# Altium schematic sheet VFD_alpha_Sheet2.SchDoc
size A4
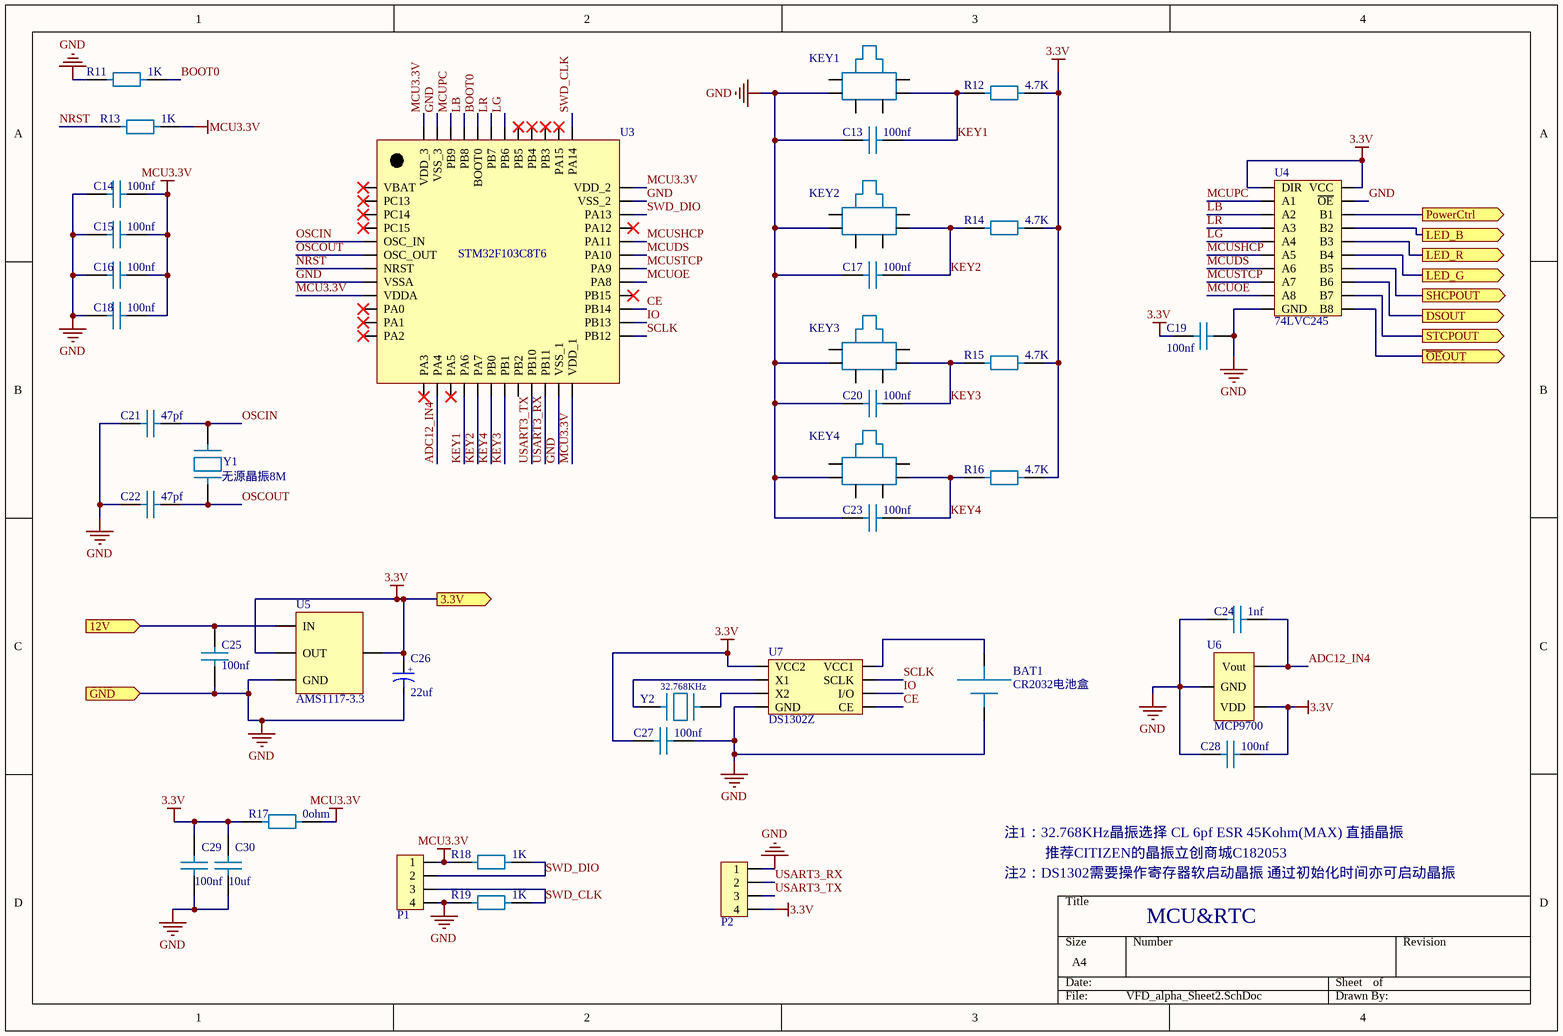
[diagram p0: VFD_alpha_Sheet2.SchDoc]

## Parts
BAT1  CR2032电池盒  [SBAT-CR2032]
C13  value 100nf  [0603]  (hidden comment: C)
C14  value 100nf  [0603]  (hidden comment: C)
C15  value 100nf  [0603]  (hidden comment: C)
C16  value 100nf  [0603]  (hidden comment: C)
C17  value 100nf  [0603]  (hidden comment: C)
C18  value 100nf  [0603]  (hidden comment: C)
C19  value 100nf  [0603]  (hidden comment: C)
C20  value 100nf  [0603]  (hidden comment: C)
C21  value 47pf  [0603]  (hidden comment: C)
C22  value 47pf  [0603]  (hidden comment: C)
C23  value 100nf  [0603]  (hidden comment: C)
C24  value 1nf  [0603]  (hidden comment: C)
C25  value 100nf  [0805]  (hidden comment: C(0805))
C26  value 22uf  [CAPCP3216X06N]  (hidden comment: 钽电容)
C27  value 100nf  [0603]  (hidden comment: C)
C28  value 100nf  [0603]  (hidden comment: C)
C29  value 100nf  [0603]  (hidden comment: C)
C30  value 10uf  [0603]  (hidden comment: C)
KEY1  无锁按键  [侧面按键]  (value not drawn)
KEY2  无锁按键  [侧面按键]  (value not drawn)
KEY3  无锁按键  [侧面按键]  (value not drawn)
KEY4  无锁按键  [侧面按键]  (value not drawn)
P1  连接器4P  [Connector4P]  (value not drawn)
P2  连接器4P  [Connector4P]  (value not drawn)
R11  value 1K  [0603]  (hidden comment: R)
R12  value 4.7K  [0603]  (hidden comment: R)
R13  value 1K  [0603]  (hidden comment: R)
R14  value 4.7K  [0603]  (hidden comment: R)
R15  value 4.7K  [0603]  (hidden comment: R)
R16  value 4.7K  [0603]  (hidden comment: R)
R17  value 0ohm  [0603]  (hidden comment: R)
R18  value 1K  [0603]  (hidden comment: R)
R19  value 1K  [0603]  (hidden comment: R)
U3  STM32F103C8T6  [STM32F103x8LQFP48]
U4  74LVC245  [TSOP-20N-74LVC245]
U5  AMS1117-3.3  [AMS1117-3.3]
U6  MCP9700  [SOT-23-s8550]
U7  DS1302Z  [SOIC-8P DS1302Z]
Y1  无源晶振8M  [晶振8M]
Y2  直插无源晶振32.768KHz  [2*6_OSC]  (value not drawn)

## Ports
3.3V (out), 12V (in), DSOUT (out), GND (in), LED_B (out), LED_G (out), LED_R (out), PowerCtrl (out), SHCPOUT (out), STCPOUT (out), ~{OE}OUT (out)

## Nets
3.3V: C19.1 C26.1 C27.1 C28.2 C29.2 C30.2 P2.4 R12.2 R14.2 R15.2 R16.2 R17.1 U4.1(DIR) U4.20(VCC) U5.2(OUT) U5.4 U6.1(VDD) U7.1(VCC2) ; port 3.3V
GND: BAT1.1 C13.1 C14.1 C15.1 C16.1 C17.1 C18.1 C19.2 C20.1 C21.1 C22.1 C23.1 C24.1 C25.1 C26.2 C27.2 C28.1 C29.1 C30.1 KEY1.2 KEY2.2 KEY3.2 KEY4.2 P1.4 P2.1 R11.2 R19.1 U3.8(VSSA) U3.23(VSS_1) U3.35(VSS_2) U3.47(VSS_3) U4.10(GND) U4.19(~{OE}) U5.1(GND) U6.2(GND) U7.4(GND) ; port GND
MCU3.3V: C14.2 C15.2 C16.2 C18.2 P1.1 R13.2 R17.2 R18.2 U3.9(VDDA) U3.24(VDD_1) U3.36(VDD_2) U3.48(VDD_3)
12V: C25.2 U5.3(IN) ; port 12V
~{OE}OUT: U4.11(B8) ; port ~{OE}OUT
ADC12_IN4: C24.2 U3.14(PA4) U6.3(Vout)
BOOT0: R11.1 U3.44(BOOT0)
CE: U3.27(PB14) U7.5(CE)
DSOUT: U4.13(B6) ; port DSOUT
IO: U3.26(PB13) U7.6(I/O)
KEY1: C13.2 KEY1.5 R12.1 U3.16(PA6)
KEY2: C17.2 KEY2.5 R14.1 U3.17(PA7)
KEY3: C20.2 KEY3.5 R15.1 U3.19(PB1)
KEY4: C23.2 KEY4.5 R16.1 U3.18(PB0)
LB: U3.45(PB8) U4.3(A2)
LED_B: U4.17(B2) ; port LED_B
LED_G: U4.15(B4) ; port LED_G
LED_R: U4.16(B3) ; port LED_R
LG: U3.42(PB6) U4.5(A4)
LR: U3.43(PB7) U4.4(A3)
MCUDS: U3.31(PA10) U4.7(A6)
MCUOE: U3.29(PA8) U4.9(A8)
MCUPC: U3.46(PB9) U4.2(A1)
MCUSHCP: U3.32(PA11) U4.6(A5)
MCUSTCP: U3.30(PA9) U4.8(A7)
NRST: R13.1 U3.7(NRST)
OSCIN: C21.2 U3.5(OSC_IN) Y1.2
OSCOUT: C22.2 U3.6(OSC_OUT) Y1.1
PowerCtrl: U4.18(B1) ; port PowerCtrl
SCLK: U3.25(PB12) U7.7(SCLK)
SHCPOUT: U4.14(B5) ; port SHCPOUT
STCPOUT: U4.12(B7) ; port STCPOUT
SWD_CLK: P1.3 R19.2 U3.37(PA14)
SWD_DIO: P1.2 R18.1 U3.34(PA13)
USART3_RX: P2.2 U3.22(PB11)
USART3_TX: P2.3 U3.21(PB10)
NetBAT1_2: BAT1.2 U7.8(VCC1)
NetU7_2: U7.2(X1) Y2.1
NetU7_3: U7.3(X2) Y2.2

Not connected (* = marked no-connect by the designer): KEY1 1 3 4 6; KEY2 1 3 4 6; KEY3 1 3 4 6; KEY4 1 3 4 6; U3 1(VBAT)* 2(PC13)* 3(PC14)* 4(PC15)* 10(PA0)* 11(PA1)* 12(PA2)* 13(PA3)* 15(PA5)* 20(PB2) 28(PB15)* 33(PA12)* 38(PA15)* 39(PB3)* 40(PB4)* 41(PB5)*

## Notes on the sheet
- 注1：32.768KHz晶振选择 CL 6pf ESR 45Kohm(MAX) 直插晶振
- 注2：DS1302需要操作寄存器软启动晶振 通过初始化时间亦可启动晶振
- 推荐CITIZEN的晶振立创商城C182053
- MCU&RTC
- (in symbol 直插无源晶振32.768KHz) 32.768KHz
- (in symbol 钽电容(3216)) +

## Library data of the parts
C13-C24 C27-C30 = C(0603)
C26 = 钽电容(3216)
R11-R19 = R(0603)
U5 = AMS1117-X
Y1 = 无源晶振8M: value: 无源晶振8M